# EasyEDA Pro project ProPrj_trying to make a watch__2026-06-22.epro, schematic Schematic1_8
Board Name: zbackup; Create Date: 2026-05-31; Page Name: P1; Project Name: Project Name; Schematic Name: Schematic Name; Update Date: 2021.11.05; Company: EasyEDA.com; Page Size: A4; Version: V1.0
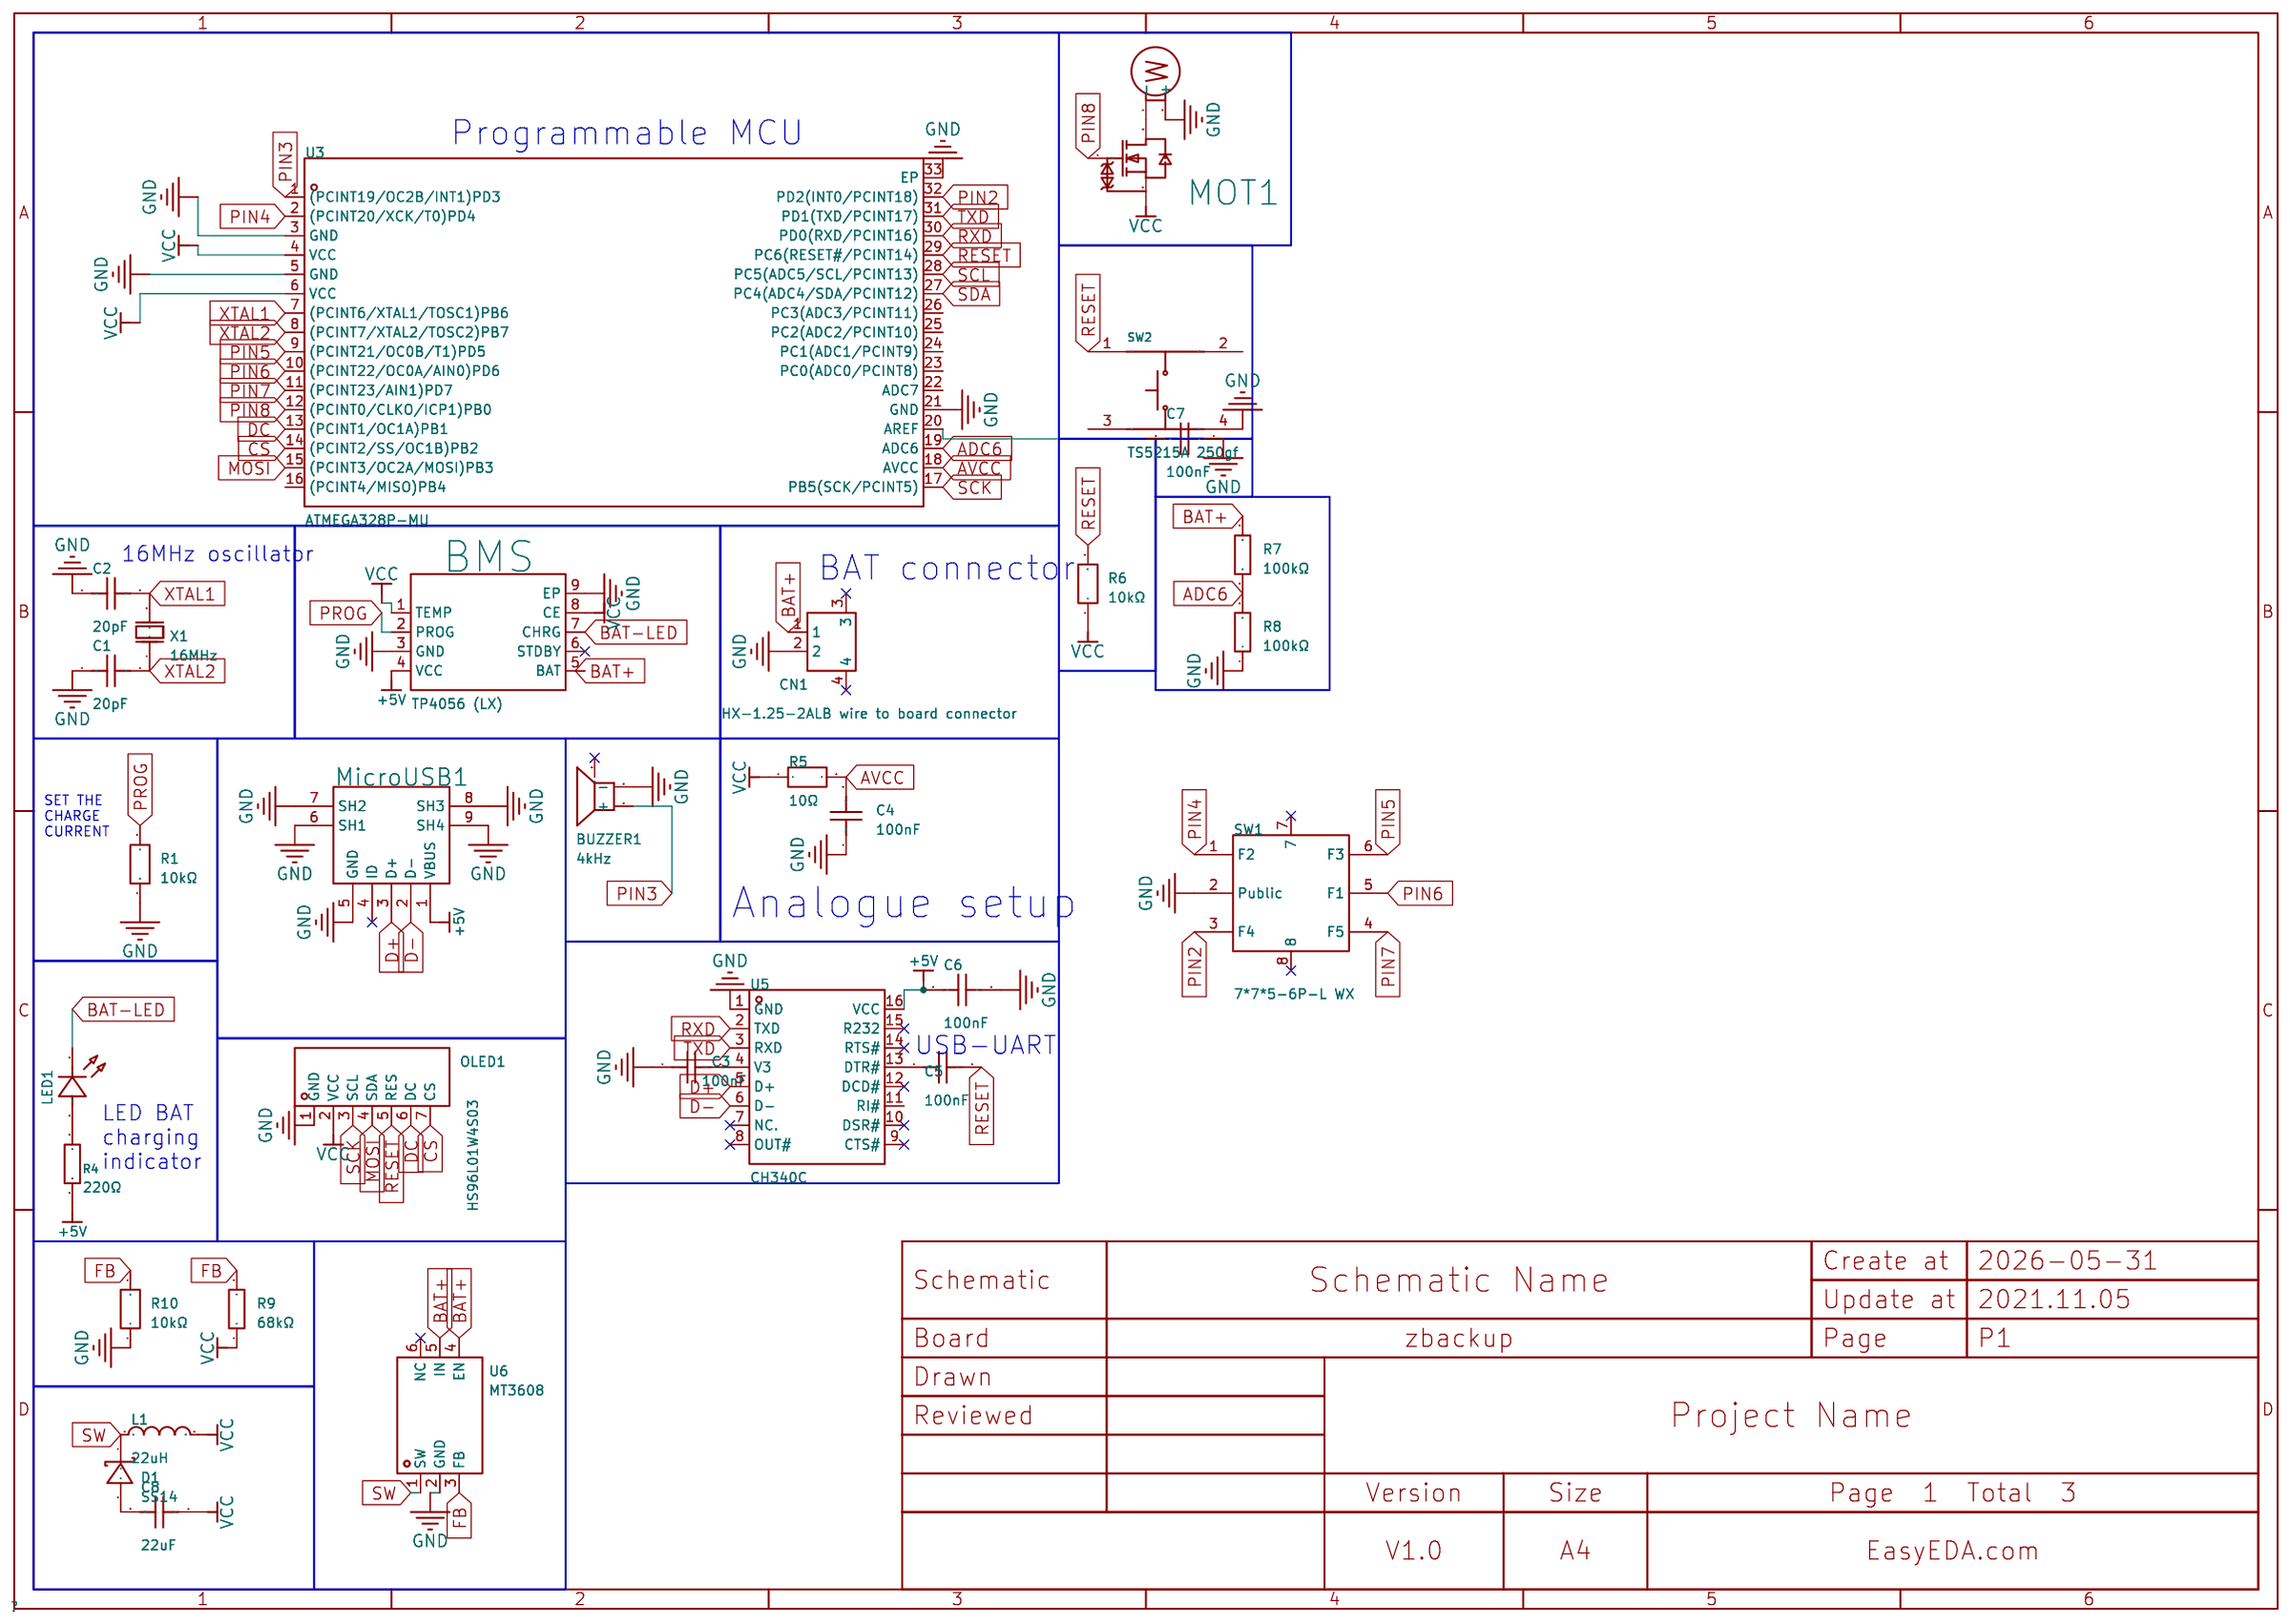
[diagram p1: schematic sheet]

## Parts
BMS  TP4056 (LX)  [ESOP-8_L4.9-W3.9-P1.27-LS6.0-BL-EP]
BUZZER1  4kHz  [BUZ-SMD_L5.0-W5.5-P4.60]
C1  20pF  [C0201]
C2  20pF  [C0201]
C3  100nF  [C0201]
C4  100nF  [C0201]
C5  100nF  [C0201]
C6  100nF  [C0201]
C7  100nF  [C0201]
C8  22uF  [C0805]
CN1  HX-1.25-2ALB wire to board connector  [CONN-SMD_2P-P1.25-MX1.25-2P-LT-1]
D1  SS14  [SMA_L4.2-W2.6-LS5.0-RD_1]
L1  22uH  [IND-SMD_L7.0-W6.6_AAPS0630]
LED1  XL-1608SURC-06  [LED0603-RD_RED]
MicroUSB1  MicroXNJ  [MICRO-USB-SMD_MICROXNJ_1]
MOT1  LCM1027A2445F  [VIBRATING-MOTOR-SMD_WELDING]
OLED1  HS96L01W4S03  [OLED-TH_HS96L01W4S03]
Q1  L2N7002SLLT1G  [SOT-23-3_L3.0-W1.7-P0.95-LS2.9-BR]
R1  10kΩ  [R0402]
R4  220Ω  [R0402]
R5  10Ω  [R0603]
R6  10kΩ  [R0402]
R7  100kΩ  [R0402]
R8  100kΩ  [R0402]
R9  68kΩ  [R0603]
R10  10kΩ  [R0402]
SW1  7*7*5-6P-L WX  [SW-SMD_8P-L7.0-W7.0-P1.40-LS7.4-TL]
SW2  TS5215A 250gf  [SW-SMD_4P-L5.2-W5.2-P3.70-LS6.4]
U3  ATMEGA328P-MU  [HVQFN-32_L5.0-W5.0-P0.50-TL-EP3.1]
U5  CH340C  [SOP-16_L10.0-W3.9-P1.27-LS6.0-BL]
U6  MT3608  [SOT-23-6_L2.9-W1.6-P0.95-LS2.8-BL]
X1  16MHz  [OSC-SMD_2P-L5.0-W3.2]

## Library data of the parts
BMS = TP4056 (LX): The Chip Type:Charging IC Voltage - Supply:4.5V~5.5V Voltage - Supply:4.5V~5.5V Charge Current - Max:1A Charging Saturation Voltage:4.2V End-Off Voltage:- Type of Battery:Lithium Battery Number of Cells:1 Number of Cells:1 Operating Temperature:-40℃~+85℃; LCSC Part Name: 1A线性锂电池充电电路; Supplier Part: C49246856; Manufacturer: LX(灵星芯微); Supplier Footprint: ESOP-8; JLCPCB Part Class: Extended Part; Datasheet: https://item.szlcsc.com/datasheet/TP4056%2520(LX)/51674740.html; Supplier: LCSC; The Chip Type: Charging IC; Voltage - Supply: 4.5V~5.5V; Charge Current - Max: 1A; Charging Saturation Voltage: 4.2V; Type of Battery: Lithium Battery; Number of Cells: 1; Operating Temperature: -40℃~+85℃; Battery Temperature Detection: Support; Supply Current (Iq): 70uA
BUZZER1 = MLT-5020: Driver Circuitry:Passive (Externally Driven) Technology:Electromagnetic Voltage Rating:3V Voltage - Supply:2V~4V Voltage - Supply:2V~4V Frequency:4kHz Current Consumption:100mA Sound Pressure Level(SPL):75dB Length:5.2mm Width:5.2mm Height:2.5mm Operating; LCSC Part Name: 无源(外部驱动) 电磁式 4kHz; Supplier Part: C94598; Manufacturer: 华能; Supplier Footprint: SMD,5x5mm; JLCPCB Part Class: Extended Part; Datasheet: https://item.szlcsc.com/datasheet/MLT-5020/95796.html; Supplier: LCSC; Driver Circuitry: Passive (Externally Driven); Technology: Electromagnetic; Voltage Rating: 3V; Voltage - Supply: 2V~4V; Current Consumption: 100mA; Sound Pressure Level(SPL): 75dB; Length: 5.2mm; Width: 5.2mm; Height: 2.5mm; Operating Temperature: -20℃~+70℃
C1 C2 = CGA0201C0G200J500ET: Capacitance:20pF Tolerance:±5% Tolerance:±5% Voltage Rating:50V Temperature Coefficient:C0G; LCSC Part Name: 20pF ±5% 50V; Supplier Part: C22435933; Manufacturer: HRE(芯声); Supplier Footprint: 0201; JLCPCB Part Class: Extended Part; Datasheet: https://item.szlcsc.com/datasheet/CGA0201C0G200J500ET/24066914.html; Supplier: LCSC; Tolerance: ±5%; Voltage Rating: 50V; Temperature Coefficient: C0G
C3-C7 = CGA0201X5R104K100ET: Capacitance:100nF Tolerance:±10% Tolerance:±10% Voltage Rating:10V Temperature Coefficient:X5R; LCSC Part Name: 100nF ±10% 10V; Supplier Part: C6119757; Manufacturer: HRE(芯声); Supplier Footprint: 0201; JLCPCB Part Class: Extended Part; Datasheet: https://item.szlcsc.com/datasheet/CGA0201X5R104K100ET/7062463.html; Supplier: LCSC; Tolerance: ±10%; Voltage Rating: 10V; Temperature Coefficient: X5R
C8 = CL21A226KOQNNNE: Capacitance:22uF Tolerance:±10% Tolerance:±10% Voltage Rating:16V Temperature Coefficient:X5R; LCSC Part Name: 22uF ±10% 16V; Supplier Part: C296720; Manufacturer: SAMSUNG(三星); Supplier Footprint: 0805; JLCPCB Part Class: Extended Part; Datasheet: https://item.szlcsc.com/datasheet/CL21A226KOQNNNE/280885.html; Supplier: LCSC; Tolerance: ±10%; Voltage Rating: 16V; Temperature Coefficient: X5R
CN1 = HX-1.25-2ALB wire to board connector: Pins Structure:1x2P Pitch:1.25mm Mounting Type:Surface Mount,Vertical Reference Series:PicoBlade(MX 1.25) Number of Pins:2P Number of Rows:1 Number of PINs Per Row:2 Row Spacing:- Current Rating:1A Contact Material:Brass Contact Plating:Tin Operating Temp; LCSC Part Name: 1x2P 间距:1.25mm 立贴 系列:PicoBlade(MX 1.25); Supplier Part: C52016399; Manufacturer: hanxia(韩下); Supplier Footprint: SMD,P=1.25mm; JLCPCB Part Class: Extended Part; Datasheet: https://item.szlcsc.com/datasheet/HX-1.25-2ALB%2520wire%2520to%2520board%2520connector/54760444.html; Supplier: LCSC; Pins Structure: 1x2P; Pitch: 1.25mm; Mounting Type: Surface Mount,Vertical; Reference Series: PicoBlade(MX 1.25); Number of Pins: 2P; Number of Rows: 1; Number of PINs Per Row: 2; Current Rating: 1A; Contact Material: Brass; Contact Plating: Tin; Operating Temperature: -25℃~+70℃; Voltage Rating: 125V; Plastic Material: LCP; Flame Retardant Rating: UL94V-0; Color: Beige; Z-Height of the Board: 4.7mm; X-Length of Bottom Edge on Board (Spacing Line): 7.5mm; Y-Width of Bottom Edge on Board: 3.9mm
D1 = SS14_C2480: Diode Configuration:Independent Voltage - Forward(Vf@If):550mV@1A Voltage - DC Reverse(Vr):40V Current - Rectified:1A Reverse Leakage Current (Ir):300uA@40V Operating Junction Temperature Range:-55℃~+150℃ Operating Junction Temperature Range:-55℃~+150℃ No; LCSC Part Name: 电压:40V 电流:1A; Supplier Part: C2480; Manufacturer: MDD(辰达半导体); Supplier Footprint: SMA(DO-214AC); JLCPCB Part Class: Basic Part; Datasheet: https://item.szlcsc.com/datasheet/SS14/2857.html; Supplier: LCSC; Diode Configuration: Independent; Voltage - Forward(Vf@If): 550mV@1A; Voltage - DC Reverse(Vr): 40V; Current - Rectified: 1A; Reverse Leakage Current (Ir): 300uA@40V; Operating Junction Temperature Range: -55℃~+150℃; Non-Repetitive Peak Forward Surge Current: 25A
L1 = AAPS0630M220A: Inductance:22uH Tolerance:±20% Tolerance:±20% Current Rating:2.5A Current - Saturation(Isat):3.03A DC Resistance(DCR):170mΩ Ratings:AEC-Q200; LCSC Part Name: 22uH ±20% 3.03A; Supplier Part: C47327332; Manufacturer: Coilank(驰兴电感); Supplier Footprint: SMD,7.7x6.6mm; JLCPCB Part Class: Extended Part; Datasheet: https://item.szlcsc.com/datasheet/AAPS0630M220A/49538260.html; Supplier: LCSC; Tolerance: ±20%; Current Rating: 2.5A; Current - Saturation(Isat): 3.03A; DC Resistance(DCR): 170mΩ; Ratings: AEC-Q200
LED1 = XL-1608SURC-06: Lamp Holder Type:- Illumination Color:Red Voltage - Forward(Vf):2.3V Voltage - Forward(Vf):2.3V Power(Watts):50mW Forward Current:20mA Wavelength - Dominant:620nm~630nm Wavelength - Dominant:620nm~630nm Peak Wavelength:625nm Diode Configuration:- Lens Col; Supplier Part: C965799; Manufacturer: XINGLIGHT(成兴光); Supplier Footprint: 0603; JLCPCB Part Class: Extended Part; Datasheet: https://atta.szlcsc.com/upload/public/pdf/source/20250213/F9766CE804AF391355DCDD48DB3E0DAB.pdf; Supplier: LCSC; Illumination Color: Red; Voltage - Forward(Vf): 2.3V; Power(Watts): 50mW; Forward Current: 20mA; Wavelength - Dominant: 620nm~630nm; Peak Wavelength: 625nm; Lens Color: Colorless Transparent Lens; Luminous Intensity: 225mcd; Viewing Angle: 120°; Mounting Sytle: Positive Stick; Operating Temperature: -20℃~+85℃
MicroUSB1 = MicroXNJ: Connector Type:Micro-B Protocol Standard:USB 2.0 Gender:Female Mounting Type:Surface Mount, Right Angle Number of Contacts:5P Number of Ports:1 Current Rating-Power:1.8A Voltage Rating:30V Connect-Disconnect Life:5,000 times Detection color:Black Operatin; LCSC Part Name: Micro小牛角卧贴母座; Supplier Part: C404969; Manufacturer: SHOU HAN(首韩); Supplier Footprint: SMD; JLCPCB Part Class: Extended Part; Datasheet: https://item.szlcsc.com/datasheet/MicroXNJ/392534.html; Supplier: LCSC; Connector Type: Micro-B; Protocol Standard: USB 2.0; Gender: Female; Mounting Type: Surface Mount, Right Angle; Number of Contacts: 5P; Number of Ports: 1; Current Rating-Power: 1.8A; Voltage Rating: 30V; Connect-Disconnect Life: 5,000 times; Detection color: Black; Operating Temperature: -20℃~+85℃
MOT1 = LCM1027A2445F: Type:Flat Vibration Motor Voltage Rating:3V Voltage Rating:3V Current Rating:80mA Rated Speed:13500rpm Rated Speed:13500rpm Operating Temperature:-20℃~+60℃ Operating Temperature:-20℃~+60℃ Sense Of Rotation:CW；CCW Mounting Type:Lead Diameter (φD):9mm Lengt; LCSC Part Name: 扁平1027 振动马达; Supplier Part: C2759984; Manufacturer: LEADER(立得); JLCPCB Part Class: Extended Part; Datasheet: https://item.szlcsc.com/datasheet/LCM1027A2445F/2880062.html; Supplier: LCSC; Type: Flat Vibration Motor; Voltage Rating: 3V; Current Rating: 80mA; Rated Speed: 13500rpm; Operating Temperature: -20℃~+60℃; Sense Of Rotation: CW；CCW; Mounting Type: Lead; Diameter (φD): 9mm; Height: 2.7mm
OLED1 = HS96L01W4S03: Size:0.96 Dot Pixels:128x64 Operating Temperature:-40℃~+80℃ Operating Temperature:-40℃~+80℃ Type of Drive:Passive (PMOLED) Display Range:21.74x10.86mm Display Color:White Luminance:100cd/m2 Quiescent Current:5uA; LCSC Part Name: 0.96寸 白光 128x64像素分辨率; Supplier Part: C5139758; Manufacturer: HS(汉昇); JLCPCB Part Class: Extended Part; Datasheet: https://item.szlcsc.com/datasheet/HS96L01W4S03/5751920.html; Supplier: LCSC; Size: 0.96; Dot Pixels: 128x64; Operating Temperature: -40℃~+80℃; Type of Drive: Passive (PMOLED); Display Range: 21.74x10.86mm; Display Color: White; Luminance: 100cd/m2; Quiescent Current: 5uA
Q1 = L2N7002SLLT1G: Type:1 N-channel Drain to Source Voltage:60V Current - Continuous Drain(Id): RDS(on):2.8Ω@10V,500mA Pd - Power Dissipation:300mW Gate Threshold Voltage (Vgs(th)@Id):- Gate Charge(Qg):440pC@4.5V Input Capacitance(Ciss@Vds):35pF@25V Reverse Transfer Capacit; LCSC Part Name: 1个N沟道 耐压:60V 电流:380mA; Supplier Part: C22446827; Manufacturer: LRC(乐山无线电); Supplier Footprint: SOT-23; JLCPCB Part Class: Extended Part; Datasheet: https://atta.szlcsc.com/upload/public/pdf/source/20240529/804683F6F610BC810C43B61F364F3FCA.pdf; Supplier: LCSC; Type: 1 N-channel; Drain to Source Voltage: 60V; RDS(on): 2.8Ω@10V,500mA; Pd - Power Dissipation: 300mW; Gate Charge(Qg): 440pC@4.5V; Input Capacitance(Ciss@Vds): 35pF@25V; Operating Temperature: -55℃~+150℃
R1 R6 R10 = FRC0402F1002TS: Type:Thick Film Resistor Resistance:10kΩ Tolerance:±1% Tolerance:±1% Power(Watts):62.5mW Voltage-Supply(Max):50V Temperature Coefficient:±100ppm/℃ Temperature Coefficient:±100ppm/℃ Operating Temperature:-55℃~+155℃ Operating Temperature:-55℃~+155℃; LCSC Part Name: 10kΩ ±1% 62.5mW 厚膜电阻; Supplier Part: C2906861; Manufacturer: FOJAN(富捷); Supplier Footprint: 0402; JLCPCB Part Class: Extended Part; Datasheet: https://item.szlcsc.com/datasheet/FRC0402F1002TS/3180374.html; Supplier: LCSC; Type: Thick Film Resistor; Tolerance: ±1%; Power(Watts): 62.5mW; Voltage-Supply(Max): 50V; Temperature Coefficient: ±100ppm/℃; Operating Temperature: -55℃~+155℃
R4 = 0402WGF2200TCE: Type:Thick Film Resistor Resistance:220Ω Tolerance:±1% Tolerance:±1% Power(Watts):62.5mW Voltage-Supply(Max):50V Temperature Coefficient:±100ppm/℃ Temperature Coefficient:±100ppm/℃ Operating Temperature:-55℃~+155℃ Operating Temperature:-55℃~+155℃; LCSC Part Name: 220Ω ±1% 62.5mW 厚膜电阻; Supplier Part: C25091; Manufacturer: UNI-ROYAL(厚声); Supplier Footprint: 0402; JLCPCB Part Class: Basic Part; Datasheet: https://item.szlcsc.com/datasheet/0402WGF2200TCE/25834.html; Supplier: LCSC; Type: Thick Film Resistor; Tolerance: ±1%; Power(Watts): 62.5mW; Voltage-Supply(Max): 50V; Temperature Coefficient: ±100ppm/℃; Operating Temperature: -55℃~+155℃
R5 = FRC0603J100 TS: Type:Thick Film Resistor Resistance:10Ω Tolerance:±5% Tolerance:±5% Power(Watts):100mW Voltage-Supply(Max):75V Temperature Coefficient:±100ppm/℃ Temperature Coefficient:±100ppm/℃ Operating Temperature:-55℃~+155℃ Operating Temperature:-55℃~+155℃; LCSC Part Name: 10Ω ±5% 100mW 厚膜电阻; Supplier Part: C2907091; Manufacturer: FOJAN(富捷); Supplier Footprint: 0603; JLCPCB Part Class: Extended Part; Supplier: LCSC; Type: Thick Film Resistor; Tolerance: ±5%; Power(Watts): 100mW; Voltage-Supply(Max): 75V; Temperature Coefficient: ±100ppm/℃; Operating Temperature: -55℃~+155℃
R7 R8 = RC0402FR-07100KL: Type:Thick Film Resistor Resistance:100kΩ Tolerance:±1% Tolerance:±1% Power(Watts):62.5mW Voltage-Supply(Max):50V Temperature Coefficient:±100ppm/℃ Temperature Coefficient:±100ppm/℃ Operating Temperature:-55℃~+155℃ Operating Temperature:-55℃~+155℃; LCSC Part Name: 厚膜电阻 100kΩ ±1% 62.5mW; Supplier Part: C60491; Manufacturer: YAGEO(国巨); Supplier Footprint: 0402; JLCPCB Part Class: Extended Part; Datasheet: https://item.szlcsc.com/datasheet/RC0402FR-07100KL/61543.html; Supplier: LCSC; Type: Thick Film Resistor; Tolerance: ±1%; Power(Watts): 62.5mW; Voltage-Supply(Max): 50V; Temperature Coefficient: ±100ppm/℃; Operating Temperature: -55℃~+155℃
R9 = RC0603FR-0768KL: Type:Thick Film Resistor Resistance:68kΩ Tolerance:±1% Tolerance:±1% Power(Watts):100mW Voltage-Supply(Max):75V Temperature Coefficient:±100ppm/℃ Temperature Coefficient:±100ppm/℃ Operating Temperature:-55℃~+155℃ Operating Temperature:-55℃~+155℃; LCSC Part Name: 厚膜电阻 68kΩ ±1% 100mW; Supplier Part: C114633; Manufacturer: YAGEO(国巨); Supplier Footprint: 0603; JLCPCB Part Class: Extended Part; Datasheet: https://item.szlcsc.com/datasheet/RC0603FR-0768KL/115877.html; Supplier: LCSC; Type: Thick Film Resistor; Tolerance: ±1%; Power(Watts): 100mW; Voltage-Supply(Max): 75V; Temperature Coefficient: ±100ppm/℃; Operating Temperature: -55℃~+155℃
SW1 = 7*7*5-6P-L WX: Circuit:SP5T Mounting Type:Vertical welding Voltage Rating:12V Current Rating:50mA Mechanical Life:50,000 cycles Operating Temperature:-20℃~+70℃ Operating Temperature:-20℃~+70℃; LCSC Part Name: 7*7*5-6P贴片五向开关L型 编带; Supplier Part: C2858287; Manufacturer: SHOU HAN(首韩); Supplier Footprint: SMD-6P,7x7mm; JLCPCB Part Class: Extended Part; Datasheet: https://item.szlcsc.com/datasheet/7*7*5-6P-L%2520WX/3059437.html; Supplier: LCSC; Circuit: SP5T; Mounting Type: Vertical welding; Voltage Rating: 12V; Current Rating: 50mA; Mechanical Life: 50,000 cycles; Operating Temperature: -20℃~+70℃
SW2 = TS5215A 250gf: Circuit:SPST Actuator Style:Round Button Operating Force:2.5N Mounting Type:Surface Mount,Vertical Length:5.2mm Width:5.2mm Switch Height:1.5mm with Bracket:Without Bracket Contact Current:50mA Voltage Rating:12V Actuator/Cap Color:Gold With Lamp:No Termi; LCSC Part Name: 5.2*5.2*1.5mm 立贴 轻触开关; Supplier Part: C388295; Manufacturer: SHOU HAN(首韩); Supplier Footprint: SMD-4P,5.2x5.2mm; JLCPCB Part Class: Extended Part; Datasheet: https://item.szlcsc.com/datasheet/TS5215A%2520250gf/363186.html; Supplier: LCSC; Circuit: SPST; Actuator Style: Round Button; Operating Force: 2.5N; Mounting Type: Surface Mount,Vertical; Length: 5.2mm; Width: 5.2mm; Switch Height: 1.5mm; with Bracket: Without Bracket; Contact Current: 50mA; Voltage Rating: 12V; Actuator/Cap Color: Gold; With Lamp: No; Termination Style: Gull Wing; Life: 100,000 cycles; Operating Temperature: -25℃~+70℃
U3 = ATMEGA328P-MU_C7499261: CPU Core:AVR CPU Maximum Speed:20MHz Core Size:8 Bit Program Storage Size:32KB Program Memory Type:FLASH RAM Size:2KB EEPROM:1KB Number of I/O:23 ADC (Bit):10bit Oscillator Type:Built-in Voltage - Supply:1.8V~5.5V Voltage - Supply:1.8V~5.5V Operating Temp; LCSC Part Name: 低功耗CMOS 8位微控制器; Supplier Part: C7499261; Manufacturer: MICROCHIP(美国微芯); Supplier Footprint: VQFN-32(5x5); JLCPCB Part Class: Extended Part; Datasheet: https://item.szlcsc.com/datasheet/ATMEGA328P-MU/8573735.html; Supplier: LCSC; CPU Core: AVR; CPU Maximum Speed: 20MHz; Core Size: 8 Bit; Program Storage Size: 32KB; Program Memory Type: FLASH; RAM Size: 2KB; EEPROM: 1KB; Number of I/O: 23; ADC (Bit): 10bit; Oscillator Type: Built-in; Voltage - Supply: 1.8V~5.5V; Operating Temperature: -40℃~+85℃; Features: Undervoltage detection (BOR/LVD/LVR/LVI)；Power-on reset (POR)；Watchdog reset；Built-in general-purpose timer；Built-in temperature sensor；Programmable watchdog；Touch function；External pin reset (NRST)
U5 = CH340C: Applications Function:Transceiver USB Protocol:USB 2.0 Voltage - Supply:3.3V；5V Voltage - Supply:3.3V；5V Data Rate:2Mbps Operating Temperature:-20℃~+70℃ Operating Temperature:-20℃~+70℃ Current - Supply:7mA Supply Current (Iq):50uA; LCSC Part Name: USB转串口芯片; Supplier Part: C84681; Manufacturer: WCH(南京沁恒); Supplier Footprint: SOP-16; JLCPCB Part Class: Extended Part; Datasheet: https://item.szlcsc.com/datasheet/CH340C/85852.html; Supplier: LCSC; Applications Function: Transceiver; USB Protocol: USB 2.0; Voltage - Supply: 3.3V；5V; Data Rate: 2Mbps; Operating Temperature: -20℃~+70℃; Current - Supply: 7mA; Supply Current (Iq): 50uA
U6 = MT3608: Function:Boost Output Type:Adjustable Voltage - Supply:2V~24V Voltage - Supply:2V~24V Output Voltage:- Output Voltage:- Output Current:2A Frequency - Switching:1.2MHz Frequency - Switching:1.2MHz Operating Temperature:-40℃~+85℃ Operating Temperature:-40℃~; LCSC Part Name: 老版本 高效1.2MHz 2A升压转换器; Supplier Part: C84817; Manufacturer: 西安航天民芯; Supplier Footprint: SOT-23-6; JLCPCB Part Class: Extended Part; Datasheet: https://item.szlcsc.com/datasheet/MT3608/85988.html; Supplier: LCSC; Function: Boost; Output Type: Adjustable; Voltage - Supply: 2V~24V; Output Current: 2A; Frequency - Switching: 1.2MHz; Operating Temperature: -40℃~+85℃; Synchronous Rectifier: No; Number of Outputs: 1; Topology: Boost; Quiescent Current: 100uA；1.6mA; Switch tube (built-in/external): Built-in
X1 = XSHEELNANF-16MHZ: Type:Surface Mount Crystal Frequency:16MHz Normal temperature Frequency Tolerance:±30ppm Normal temperature Frequency Tolerance:±30ppm Load Capacitance:20pF Frequency Stability:±30ppm Frequency Stability:±30ppm Operating Temperature:-40℃~+85℃ Operating Te; LCSC Part Name: 16MHz ±30ppm 20pF; Supplier Part: C242221; Manufacturer: TAITIEN(泰艺电子); Supplier Footprint: SMD5032; JLCPCB Part Class: Extended Part; Datasheet: https://atta.szlcsc.com/upload/public/pdf/source/20180704/C242221_71476AA24F58019514D39B5873D4BE18.pdf; Supplier: LCSC; Type: Surface Mount Crystal; Normal temperature Frequency Tolerance: ±30ppm; Load Capacitance: 20pF; Frequency Stability: ±30ppm; Operating Temperature: -40℃~+85℃

## Nets
+5V: BMS.4(VCC) C6.1 MicroUSB1.1(VBUS) R4.1 U5.16(VCC)
AVCC: C4.2 R5.2 U3.18(AVCC)
GND: BMS.3(GND) BMS.9(EP) BUZZER1.2(-) C1.1 C2.1 C3.1 C4.1 C6.2 C7.1 CN1.2 MicroUSB1.5(GND) MicroUSB1.6(SH1) MicroUSB1.7(SH2) MicroUSB1.8(SH3) MicroUSB1.9(SH4) MOT1.2(+) OLED1.1(GND) R1.1 R8.1 R10.1 SW1.2(Public) SW2.4 U3.3(GND) U3.5(GND) U3.21(GND) U3.33(EP) U5.1(GND) U6.2(GND)
VCC: BMS.1(TEMP) BMS.8(CE) C8.1 L1.2 OLED1.2(VCC) Q1.2(S) R5.1 R6.1 R9.1 U3.4(VCC) U3.6(VCC)
ADC6: R7.1 R8.2 U3.19(ADC6)
BAT+: BMS.5(BAT) CN1.1 R7.2 U6.4(EN) U6.5(IN)
BAT-LED: BMS.7(CHRG) LED1.1(K)
CS: OLED1.7(CS) U3.14((PCINT2/SS/OC1B)PB2)
D+: MicroUSB1.3(D+) U5.5(D+)
D-: MicroUSB1.2(D-) U5.6(D-)
DC: OLED1.6(DC) U3.13((PCINT1/OC1A)PB1)
FB: R9.2 R10.2 U6.3(FB)
MOSI: OLED1.4(SDA) U3.15((PCINT3/OC2A/MOSI)PB3)
PIN2: SW1.3(F4) U3.32(PD2(INT0/PCINT18))
PIN3: BUZZER1.1(+) U3.1((PCINT19/OC2B/INT1)PD3)
PIN4: SW1.1(F2) U3.2((PCINT20/XCK/T0)PD4)
PIN5: SW1.6(F3) U3.9((PCINT21/OC0B/T1)PD5)
PIN6: SW1.5(F1) U3.10((PCINT22/OC0A/AIN0)PD6)
PIN7: SW1.4(F5) U3.11((PCINT23/AIN1)PD7)
PIN8: Q1.1(G) U3.12((PCINT0/CLKO/ICP1)PB0)
PROG: BMS.2(PROG) R1.2
RESET: C5.2 OLED1.5(RES) R6.2 SW2.1 U3.29(PC6(RESET#/PCINT14))
RXD: U3.30(PD0(RXD/PCINT16)) U5.2(TXD)
SCK: OLED1.3(SCL) U3.17(PB5(SCK/PCINT5))
SCL: U3.28(PC5(ADC5/SCL/PCINT13))
SDA: U3.27(PC4(ADC4/SDA/PCINT12))
SW: D1.1(K) L1.1 U6.1(SW)
TXD: U3.31(PD1(TXD/PCINT17)) U5.3(RXD)
XTAL1: C2.2 U3.7((PCINT6/XTAL1/TOSC1)PB6) X1.2(OSC2)
XTAL2: C1.2 U3.8((PCINT7/XTAL2/TOSC2)PB7) X1.1(OSC1)
$1N13873: LED1.2(A) R4.2
$1N14986: C3.2 U5.4(V3)
$1N16662: MOT1.1(-) Q1.3(D)
$1N17222: C5.1 U5.13(DTR#)
$1N17389: C7.2 U3.20(AREF)
$1N19770: C8.2 D1.2(A)

Not connected (* = marked no-connect by the designer): BMS 6(STDBY)*; BUZZER1 3(NC)*; CN1 3* 4*; MicroUSB1 4(ID)*; SW1 7* 8*; SW2 2 3; U3 16((PCINT4/MISO)PB4) 22(ADC7) 23(PC0(ADC0/PCINT8)) 24(PC1(ADC1/PCINT9)) 25(PC2(ADC2/PCINT10)) 26(PC3(ADC3/PCINT11)); U5 7(NC.)* 8(OUT#)* 9(CTS#)* 10(DSR#)* 11(RI#) 12(DCD#)* 14(RTS#)* 15(R232)*; U6 6(NC)*

## Notes on the sheet
- Programmable MCU
- 16MHz oscillator
- BAT connector
- SET THE
  CHARGE
  CURRENT
- Analogue setup
- USB-UART
- LED BAT
  charging
  indicator
